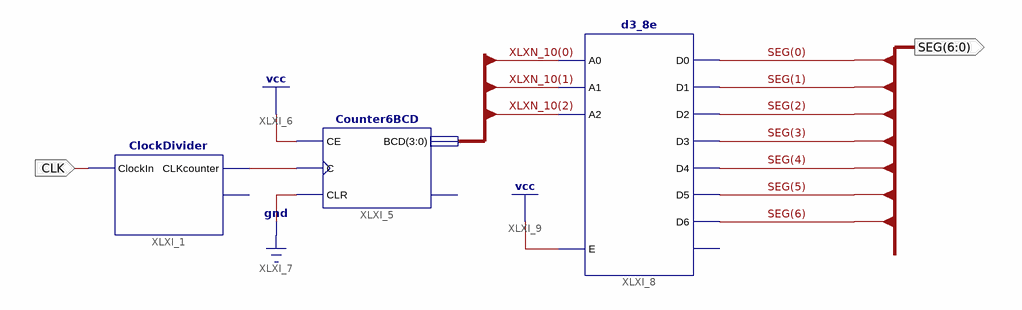
[diagram p0: schematic sheet 1]
// Xilinx ISE schematic load.sch (spartan6) as structural Verilog: 3 symbols, 2 ports
module load (
  input  CLK,
  output [6:0] SEG
);

  wire XLXN_2;
  wire [3:0] XLXN_10;

  ClockDivider XLXI_1 (.ClockIn(CLK), .CLKcounter(XLXN_2));  // open: CLK7Seg
  Counter6BCD XLXI_5 (.BCD(XLXN_10), .CE(1'b1), .C(XLXN_2), .CLR(1'b0));  // open: CEO
  d3_8e XLXI_8 (
    .A0(XLXN_10[0]), .A1(XLXN_10[1]), .A2(XLXN_10[2]), .E(1'b1), .D0(SEG[0]), .D1(SEG[1]), .D2(SEG[2]),
    .D3(SEG[3]), .D4(SEG[4]), .D5(SEG[5]), .D6(SEG[6]));  // open: D7
endmodule
